# EAGLE design Board_760032v2 (EAGLE 9.6.2)
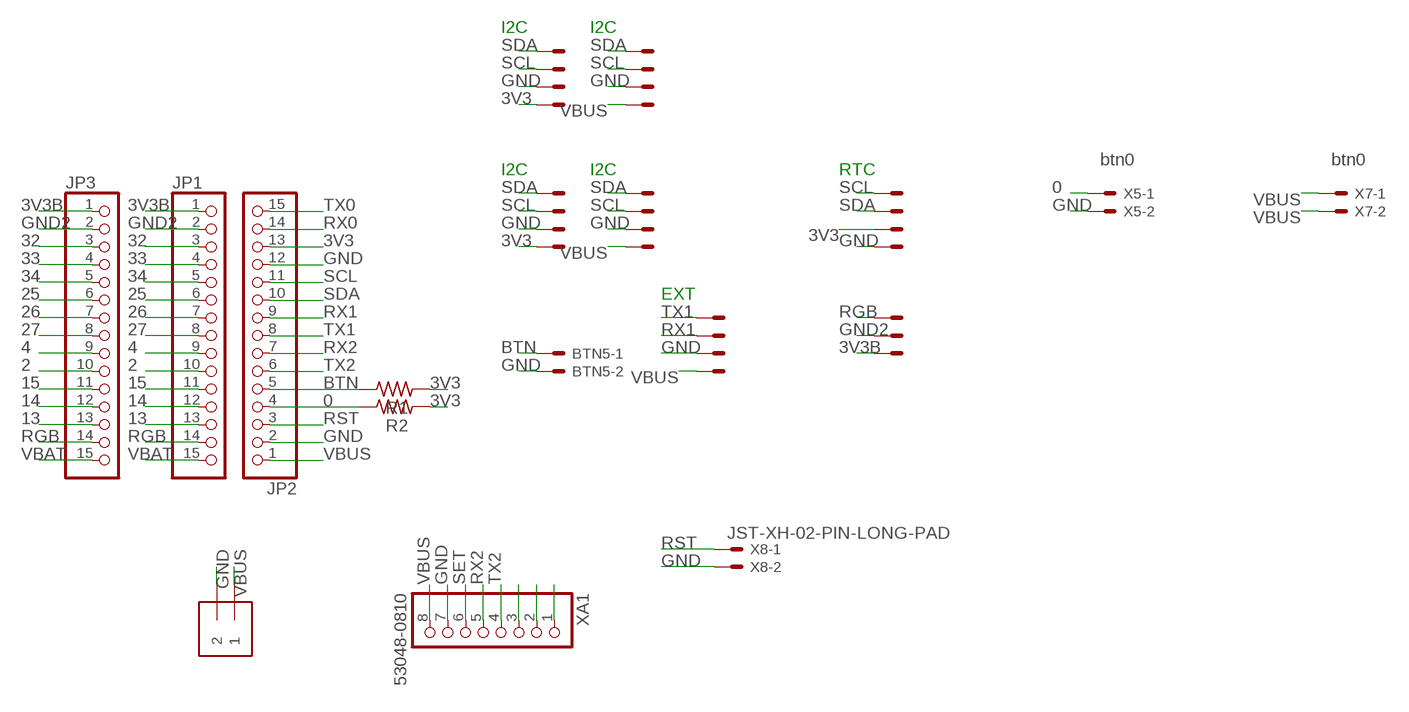
[diagram p0: schematic, sheet 1]

## Parts
BTN5  JST-XH-02-PIN-LONG-PAD  [JST-XH-02-PACKAGE-LONG-PAD]
J1  1X2-3.5MM  [1X2-3.5MM]
JP1  PINHD-1X15  [1X15]
JP2  PINHD-1X15  [1X15]
JP3  PINHD-1X15  [1X15]
R1  R-US_0207/7  [0207/7]
R2  R-US_0207/7  [0207/7]
RTC  JST-XH-04-PIN-LONG-PAD  [JST-XH-04-PACKAGE-LONG-PAD]
X1  JST-XH-04-PIN-LONG-PAD  [JST-XH-04-PACKAGE-LONG-PAD]
X2  JST-XH-04-PIN-LONG-PAD  [JST-XH-04-PACKAGE-LONG-PAD]
X3  JST-XH-04-PIN-LONG-PAD  [JST-XH-04-PACKAGE-LONG-PAD]
X4  JST-XH-03-PIN-LONG-PAD  [JST-XH-03-PACKAGE-LONG-PAD]
X5  btn0  JST-XH-02-PIN-LONG-PAD  [JST-XH-02-PACKAGE-LONG-PAD]
X6  JST-XH-04-PIN-LONG-PAD  [JST-XH-04-PACKAGE-LONG-PAD]
X7  btn0  JST-XH-02-PIN-LONG-PAD  [JST-XH-02-PACKAGE-LONG-PAD]
X8  JST-XH-02-PIN-LONG-PAD  [JST-XH-02-PACKAGE-LONG-PAD]
X9  JST-XH-04-PIN-LONG-PAD  [JST-XH-04-PACKAGE-LONG-PAD]
XA1  53048-0810  [MOLEX_53048-0810]

## Nets
0: JP2.4 R2.1 X5.1
2: JP1.10 JP3.10
3V3: JP2.13 R1.2 R2.2 RTC.3 X1.4 X3.4
3V3B: JP1.1 JP3.1 X4.3
4: JP1.9 JP3.9
13: JP1.13 JP3.13
14: JP1.12 JP3.12
15: JP1.11 JP3.11
25: JP1.6 JP3.6
26: JP1.7 JP3.7
27: JP1.8 JP3.8
32: JP1.3 JP3.3
33: JP1.4 JP3.4
34: JP1.5 JP3.5
BTN: BTN5.1 JP2.5 R1.1
GND: BTN5.2 J1.2 JP2.2 JP2.12 RTC.4 X1.3 X2.3 X3.3 X5.2 X6.3 X8.2 X9.3 XA1.7
GND2: JP1.2 JP3.2 X4.2
N$6: XA1.3
N$7: XA1.2
N$8: XA1.1
RGB: JP1.14 JP3.14 X4.1
RST: JP2.3 X8.1
RX0: JP2.14
RX1: JP2.9 X6.2
RX2: JP2.7 XA1.5
SCL: JP2.11 RTC.1 X1.2 X2.2 X3.2 X9.2
SDA: JP2.10 RTC.2 X1.1 X2.1 X3.1 X9.1
SET: XA1.6
TX0: JP2.15
TX1: JP2.8 X6.1
TX2: JP2.6 XA1.4
VBAT: JP1.15 JP3.15
VBUS: J1.1 JP2.1 X2.4 X6.4 X7.1 X7.2 X9.4 XA1.8

## Notes on the sheet
- I2C | I2C
- I2C | I2C | RTC
- EXT

## Library data of the parts
BTN5 X5 X7 X8 = Rembrandt Electronics - JST XH Connectors v1-0:JST-XH-02-PIN: JST XH Connector 2 Pin Wire to board connector. Pitch: 2,54 mm, (0.100") Number of pins: 2 Created by Rembrandt Electronics www.rembrandtelectronics.com
J1 = adafruit:1X2: 3.5mm Terminal block http://www.ladyada.net/library/pcb/eaglelibrary.html
JP1-JP3 = pinhead:PINHD-1X15: PIN HEADER
R1 R2 = rcl:R-US_: RESISTOR, American symbol; SPICEPREFIX: R
RTC X1-X3 X6 X9 = Rembrandt Electronics - JST XH Connectors v1-0:JST-XH-04-PIN: JST XH Connector 2 Pin Wire to board connector. Pitch: 2,54 mm, (0.100") Number of pins: 4 Created by Rembrandt Electronics www.rembrandtelectronics.com
X4 = Rembrandt Electronics - JST XH Connectors v1-0:JST-XH-03-PIN: JST XH Connector 2 Pin Wire to board connector. Pitch: 2,54 mm, (0.100") Number of pins: 3 Created by Rembrandt Electronics www.rembrandtelectronics.com
XA1 = ConectorPlantower:53048-0810: 1.25mm Pitch PicoBlade Header, Right Angle, 8 Circuits Check availability <https://pricing.snapeda.com/parts/53048-0810/Molex/view-part?ref=eda>; AVAILABILITY: In Stock; CHECK_PRICES: https://www.snapeda.com/parts/53048-0810/Molex/view-part/?ref=eda; DESCRIPTION: 8 way through board PCB 90deg header | Molex Incorporated 53048-0810; MF: Molex; MP: 53048-0810; PACKAGE: None; PRICE: None; PURCHASE-URL: https://www.snapeda.com/api/url_track_click_mouser/?unipart_id=53851&manufacturer=Molex&part_name=53048-0810&search_term=picoblade 1.25mm header rightangle 8way; SNAPEDA_LINK: https://www.snapeda.com/parts/53048-0810/Molex/view-part/?ref=snap

## Board
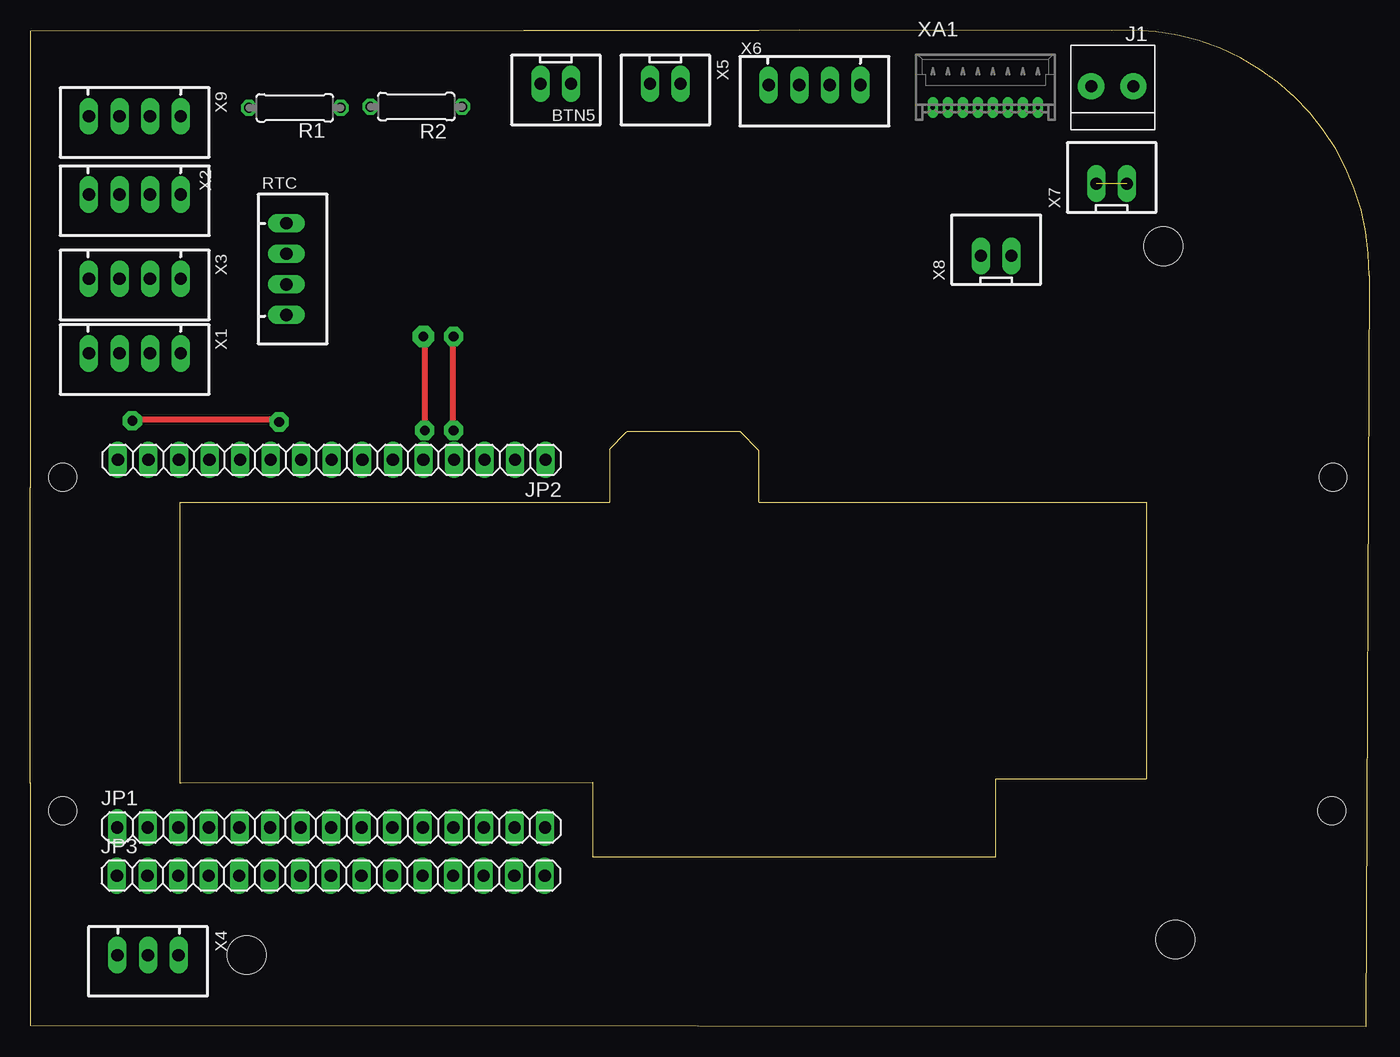
[diagram p1: board, top side]
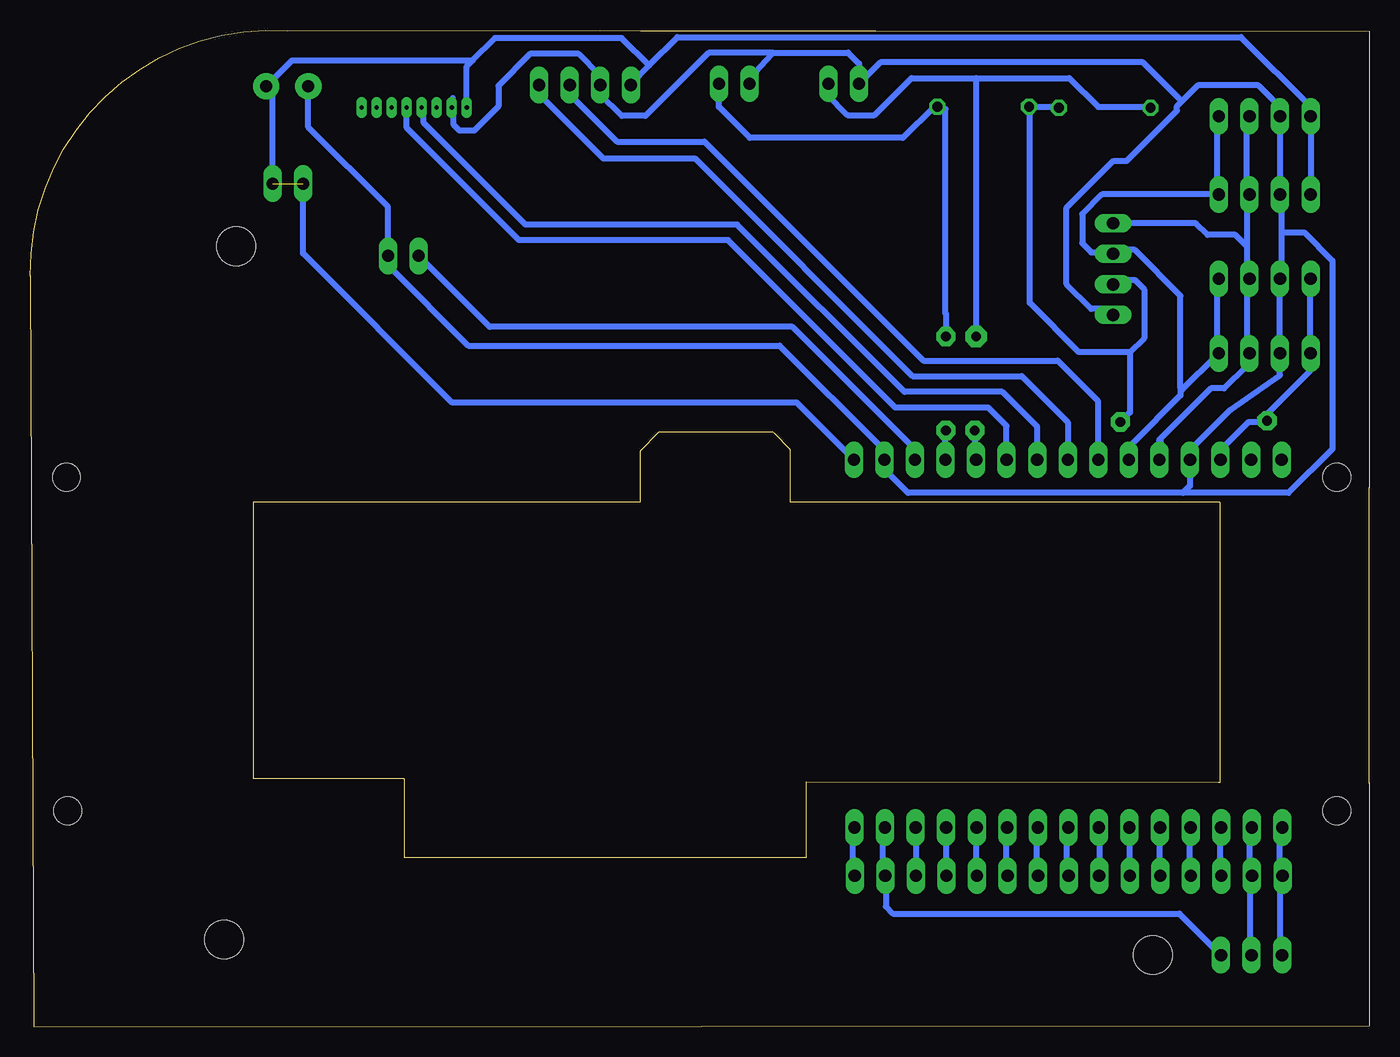
[diagram p2: board, bottom side, seen from below]

Size 111.32 x 82.81 mm. Coordinates in mm from the lower left corner, seen from the top.
Outline: 0,20.29 0,0.09 111.02,0 111.32,62.41 111.22,64.23 arc90 89.9,82.75 63.96,82.81 60.57,82.76 49.57,82.76 41,82.75 0,82.71 0,44.77
Outline: 0,20.23 0,44.82
Outline: 92.79,43.59 92.79,20.59 80.24,20.59 80.24,14.08 46.81,14.08 46.81,20.3 12.56,20.29 12.45,20.29 12.43,43.56 48.15,43.59 48.15,48 49.5,49.35 49.6,49.42 59.03,49.42 60.6,47.85 60.6,43.59 92.79,43.59
Copper layers (1*16): Top 0.035mm / dielectric 1.5mm / Bottom 0.035mm
Design rules "default *": minimum track width 0.5mm, minimum drill 0.35mm, track to track 0.8mm, track to pad 0.8mm, pad to pad 0.8mm, via to via 0.8mm, smd to smd 6mil, copper to edge 0.4mm, drill to drill 6mil, minimum pad ring 10mil, minimum via ring 8mil, stop-mask expansion 4mil, vias tented up to drill 0mil, thermal gap 10mil
Holes 2.3 mm at 2.7,45.65 108.3,45.65 108.2,17.95 2.7,17.95
Holes 3.2 mm at 94.2,64.85 95.2,7.25 18,5.95

### Footprints (pad centres in the part's own frame; a part is rotated, then mirrored left to right if it is on the bottom)
JST-XH-02-PACKAGE-LONG-PAD = drill 1.016 long: 1 -1.27,0; 2 1.27,0
1X2-3.5MM = drill 1 pad 2.184: 1 1.8,0; 2 -1.7,0
1X15 = drill 1.016 long: 1 -17.78,0; 2 -15.24,0; 3 -12.7,0; 4 -10.16,0; 5 -7.62,0; 6 -5.08,0; 7 -2.54,0; 8 0,0; 9 2.54,0; 10 5.08,0; 11 7.62,0; 12 10.16,0; 13 12.7,0; 14 15.24,0; 15 17.78,0
0207/7 = drill 0.813 octagon: 1 -3.81,0; 2 3.81,0
JST-XH-04-PACKAGE-LONG-PAD = drill 1.016 long: 1 -3.81,0; 2 -1.27,0; 3 1.27,0; 4 3.81,0
JST-XH-03-PACKAGE-LONG-PAD = drill 1.016 long: 1 -2.54,0; 2 0,0; 3 2.54,0
MOLEX_53048-0810 = drill 0.35 pad 0.597 long: 1 4.375,0.02; 2 3.125,0.02; 3 1.875,0.02; 4 0.625,0.02; 5 -0.625,0.02; 6 -1.875,0.02; 7 -3.125,0.02; 8 -4.375,0.02

### Placement (x,y rotation side)
BTN5  43.7,78.35 180 top
J1  89.9,78.15 0 top
JP1  25.02,16.56 0 top
JP2  25.08,47.1 180 top
JP3  25,12.55 0 top
R1  22,76.35 0 top
R2  32.1,76.45 180 top
RTC  21.3,62.95 270 top
X1  8.7,55.95 180 top
X2  8.7,69.15 180 top
X3  8.7,62.15 180 top
X4  9.8,5.95 180 top
X5  52.8,78.35 180 top
X6  65.2,78.25 180 top
X7  89.9,70.05 0 top
X8  80.3,64.05 0 top
X9  8.7,75.65 180 top
XA1  79.4,76.35 0 top

### Tracks (layer width: path | path; a pad name or v marks a point on that pad's centre or on a via)
0  (via drill 0.8 pad 1.6)
  Top 0.5: v35.2,57.35 35.1,57.35 35.1,49.65 v35.2,49.55
  Bottom 0.5: JP2.4 35.23,49.52 v35.2,49.55 | v35.2,57.35 35.2,59.2 35.23,59.22 35.23,76.25 R2.1 36.18,76.45 38.78,73.85 51.49,73.85 54.08,76.44 X5.1
2
  Bottom 0.5: JP3.10 30.2,12.55 30.2,16.55 JP1.10
3V3  (via drill 0.8 pad 1.6)
  Top 0.5: v20.7,50.25 20.5,50.45 8.6,50.45 v8.5,50.35
  Bottom 0.5: X1.4 4.95,56.05 4.95,62.05 5.1,62.15 X3.4 | 12.2,48.3 12.2,47.3 JP2.13 12.38,47.89 10.01,50.25 8.6,50.25 v8.5,50.35 8.5,50.92 4.89,54.53 X1.4 | 4.7,55.8 X1.4 | v20.7,50.25 19.9,51.05 19.9,56.05 | RTC.3 20.93,62.05 19.52,62.05 18.73,61.26 18.73,57.22 19.9,56.05 | 28.2,76.42 25.82,76.42 R1.2 | 28.2,76.42 R2.2 | 28.2,76.42 28.22,76.4 28.22,60.14 24.13,56.05 19.9,56.05
3V3B
  Bottom 0.5: 7.45,12.55 7.45,16.55 JP1.1 | 7.45,12.55 JP3.1 | 7.45,12.55 7.45,6.14 X4.3
4
  Bottom 0.5: JP3.9 27.7,12.55 27.7,16.55 JP1.9
13
  Bottom 0.5: JP3.13 37.7,16.55 JP1.13
14
  Bottom 0.5: JP3.12 35.2,12.55 35.2,16.55 JP1.12
15
  Bottom 0.5: JP3.11 32.7,12.55 32.7,16.55 JP1.11
25
  Bottom 0.5: JP3.6 19.95,12.55 JP1.6
26
  Bottom 0.5: JP3.7 22.45,16.55 JP1.7
27
  Bottom 0.5: JP3.8 25.2,12.55 25.2,16.55 JP1.8
32
  Bottom 0.5: JP3.3 12.45,12.55 12.45,16.55 JP1.3
33
  Bottom 0.5: JP3.4 14.95,12.55 14.95,16.55 JP1.4
34
  Bottom 0.5: JP3.5 17.45,12.55 17.45,16.55 JP1.5
BTN  (via drill 0.8 pad 1.6, 0.8 pad 1.8)
  Top 0.5: 32.7,57.45 v32.7,57.35 32.8,57.25 v32.8,49.55
  Bottom 0.5: JP2.5 32.8,47.2 v32.8,49.55 | 32.7,78.83 38.05,78.83 41.12,75.75 43.38,75.75 45.12,77.5 45.02,77.6 45.17,78.15 BTN5.1 | 32.7,78.83 24.95,78.83 22.55,76.42 18.2,76.42 R1.1 | 32.7,78.83 v32.7,57.35
GND
  Bottom 0.5: X2.3 7.45,69.3 7.45,75.55 X9.3 7.7,75.92 7.7,76.7 9.22,78.22 14.28,78.22 15.6,76.9 | JP2.12 14.83,47.19 | JP2.2 40.45,47.24 | 7.2,69.05 X2.3 | 76.33,76.3 XA1.7 76.26,76.41 | 81.45,64.05 X8.2 | 76.2,77.15 76.2,76.55 76.26,76.41 | X5.2 51.53,78.79 49.66,80.85 | 49.66,80.85 49.59,80.93 43.33,80.93 42.43,80.03 BTN5.2 40.66,80.12 18.82,80.12 15.6,76.9 | 7.33,66 7.33,68.67 7.2,68.8 X2.3 | 7.33,66 7.33,62.3 X3.3 7.45,62.05 7.45,56.05 X1.3 7.43,54.14 11.55,51.26 14.91,47.89 JP2.12 | JP2.12 14.91,44.94 15.5,44.35 | 76.26,76.41 76.1,76.25 76.1,74.93 75.64,74.46 74.41,74.46 72.4,76.47 72.4,78.19 69.76,80.82 65.72,80.82 63.93,79.03 X6.3 63.93,77.47 62.14,75.68 60.17,75.68 54.93,80.92 49.73,80.92 49.66,80.85 | 15.6,76.9 16,76.5 16,76.12 20.17,71.95 21.27,71.95 25.17,68.05 25.17,61.7 23.12,59.65 21.81,59.65 RTC.4 | JP2.2 40.52,47.3 40.52,48.09 49.03,56.6 74.91,56.6 81.45,63.14 81.45,63.93 X8.2 | X8.2 81.57,68.12 88.2,74.75 J1.2 | 15.5,44.35 38.35,44.35 40.32,46.32 JP2.2 | 15.5,44.35 6.73,44.35 3.08,48 3.08,63.66 5.42,66 7.33,66
GND2
  Bottom 0.5: 9.95,12.55 9.95,16.55 JP1.2 | 9.95,12.55 JP3.2 | 9.95,12.55 9.95,6.1 X4.2
RGB
  Bottom 0.5: JP1.14 40.45,16.55 40.45,12.55 JP3.14 40.2,12.51 40.2,9.99 39.61,9.4 15.79,9.4 X4.1
RST
  Bottom 0.5: X8.1 73.13,58.15 47.94,58.15 37.78,47.99 JP2.3
RX1
  Bottom 0.5: JP2.9 22.57,47.14 22.57,52.03 25.9,55.35 37.08,55.35 55.28,73.55 62.56,73.55 66.47,77.47 X6.2
RX2
  Bottom 0.5: XA1.5 78.6,76.2 78.6,75.09 70.16,66.65 52.55,66.65 38.65,52.75 30.51,52.75 27.61,49.85 JP2.7
SCL
  Bottom 0.5: X1.2 10.2,56.05 10.2,62.05 X3.2 10.2,62.3 10.2,64.85 | 10.2,55.55 10.2,55.8 X1.2 | 10.2,68.55 10.2,69.05 X2.2 | X9.2 10.2,75.55 10.2,69.3 X2.2 | 10.2,64.85 10.2,68.3 X2.2 | 21.3,66.65 RTC.1 14.42,66.76 13.45,65.8 11.15,65.8 10.2,64.85 | 10.2,55.55 X1.2 | 17.33,48.88 13.16,53.05 12.09,53.05 10.2,54.94 10.2,55.55 | 17.33,48.88 17.5,48.72 | JP2.11 17.33,47.23 17.33,48.88
SDA
  Bottom 0.5: X2.1 12.7,69.3 12.7,75.55 X9.1 | 12.7,61.3 12.7,62.05 X3.1 12.7,61.3 | 12.7,61.3 12.7,56.05 X1.1 12.7,55.8 15.57,52.92 15.7,53.05 | 21.25,64.2 RTC.2 | 12.95,69.3 X2.1 | 21.5,64.2 RTC.2 | 15.7,53.05 15.7,52.45 19.7,48.45 19.7,47.4 JP2.10 | RTC.2 21.43,64.35 23.12,64.35 23.87,65.1 23.87,67.51 22.23,69.15 X2.1 | 21.3,64.28 RTC.2 | RTC.2 20.97,64.55 19.52,64.55 15.7,60.73 15.7,53.05
TX1
  Bottom 0.5: 25.2,47.3 JP2.8 25.07,50.24 28.89,54.05 37.98,54.05 56.08,72.15 63.7,72.15 69.01,77.47 X6.1
TX2
  Bottom 0.5: JP2.6 30.15,49.92 31.68,51.45 39.4,51.45 53.3,65.35 70.7,65.35 80.03,74.68 XA1.4
VBAT
  Bottom 0.5: JP3.15 42.95,12.55 42.95,16.55 JP1.15
VBUS  (1 unrouted)
  Bottom 0.5: 4.95,75.8 X9.4 | 5.1,75.65 X9.4 | 42.95,47.2 JP2.1 | 42.7,47.55 JP2.1 | JP2.1 42.96,47.2 | X9.4 X2.4 | 74.53,80.29 75.03,79.8 XA1.8 74.95,76.67 | 74.53,80.29 72.67,82.15 62.15,82.15 59.88,79.88 | 59.88,79.88 57.53,82.22 10.68,82.22 4.89,76.44 X9.4 | JP2.1 47.6,51.85 76.23,51.85 88.63,64.25 X7.1 | 74.53,80.29 89.56,80.29 J1.1 91.2,77.65 91.2,70.58 91.17,70.55 X7.2 | X6.4 61.39,78.36 59.88,79.88